# EAGLE schematic PDB2_1 (EAGLE 9.3.0)

## Sheet 1 of 3: BATTERY MANAGEMENT & OUTPUTS
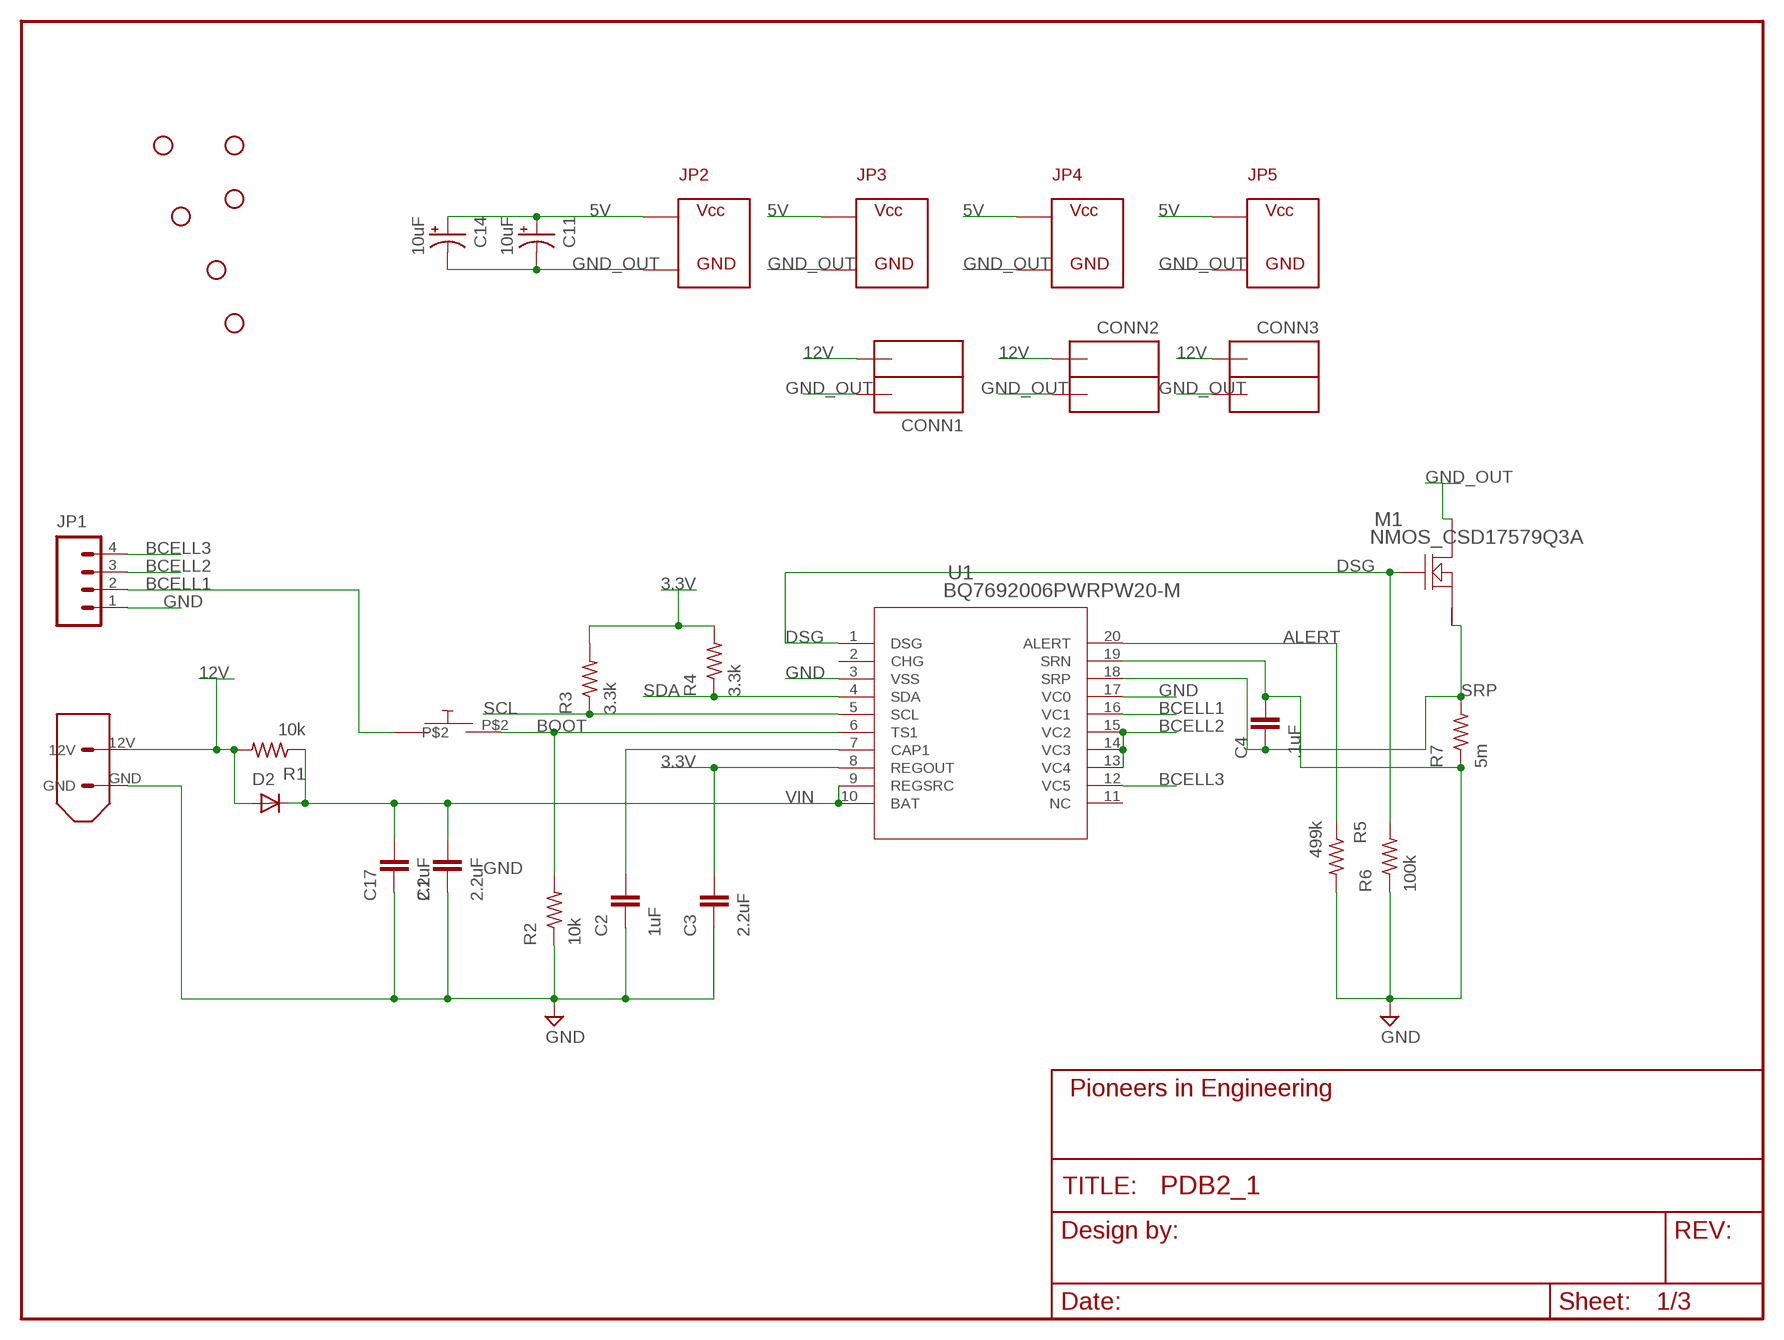
[diagram p0: schematic, sheet 1]
FRAME1 (FRAME_SCHEMATIC): AUTHOR: Sherwin A.

### Parts
C1  2.2uF  CAP0603-CAP  [0603-CAP]
C2  1uF  CAP0603-CAP  [0603-CAP]
C3  2.2uF  CAP0603-CAP  [0603-CAP]
C4  .1uF  CAP0603-CAP  [0603-CAP]
C11  10uF  CAP_POLRADIAL  [.248"CAP_THRU]
C14  10uF  CAP_POLRADIAL  [.248"CAP_THRU]
C17  2.2uF  CAP0603-CAP  [0603-CAP]
CONN1  ANDERSONVERTICAL  [ANDERSON_VERTICAL]
CONN2  ANDERSONVERTICAL  [ANDERSON_VERTICAL]
CONN3  ANDERSONVERTICAL  [ANDERSON_VERTICAL]
D2  D_MBR1020VL  [SOD-123FL]
J1  XT60CONNECTOR  [XT60CONNECTOR]
JP1  M041X04-MTA  [1X04-MTA]
JP2  ATX  [ATX]
JP3  ATX  [ATX]
JP4  ATX  [ATX]
JP5  ATX  [ATX]
M1  NMOS_CSD17579Q3A  [DNH0008A]
R1  10k  R-US_R0603  [R0603]
R2  10k  R-US_R0603  [R0603]
R3  3.3k  R-US_R0603  [R0603]
R4  3.3k  R-US_R0603  [R0603]
R5  499k  R-US_R0603  [R0603]
R6  100k  R-US_R0603  [R0603]
R7  5m  SHUNT_SMD  [SMD_SHUNT]
STANDOFF1  STAND-OFFTIGHT  [STAND-OFF-TIGHT]
STANDOFF2  STAND-OFFTIGHT  [STAND-OFF-TIGHT]
STANDOFF3  STAND-OFFTIGHT  [STAND-OFF-TIGHT]
STANDOFF4  STAND-OFFTIGHT  [STAND-OFF-TIGHT]
STANDOFF5  STAND-OFFTIGHT  [STAND-OFF-TIGHT]
STANDOFF7  STAND-OFFTIGHT  [STAND-OFF-TIGHT]
SW1  PUSH_BUTTON  [BUTTON_K12A]
U1  BQ7692006PWRPW20-M  [PW20-M]

### Nets
3.3V: C3.2 R3.2 R4.2 U1.8(REGOUT) ; also sheet 3
5V: C11.PLUS(+) C14.PLUS(+) JP2.P$1 JP3.P$1 JP4.P$1 JP5.P$1 ; also sheet 2
12V: CONN1.PIN1(OUTB) CONN2.PIN2(OUTA) CONN3.PIN2(OUTA) D2.P$2(A) J1.12V R1.2 ; also sheet 2
ALERT: R5.1 U1.20(ALERT) ; also sheet 3
BCELL1: JP1.2 SW1.P$1 U1.16(VC1)
BCELL2: JP1.3 U1.13(VC4) U1.14(VC3) U1.15(VC2)
BCELL3: JP1.4 U1.12(VC5)
BOOT: R2.2 SW1.P$2 U1.6(TS1) ; also sheet 3
CAP1: C2.2 U1.7(CAP1)
DSG: M1.4(GATE) R6.2 U1.1(DSG)
GND: C1.1 C2.1 C3.1 C4.2 C17.1 J1.GND JP1.1 R2.1 R5.2 R6.1 R7.P$1 U1.3(VSS) U1.17(VC0) U1.19(SRN) ; also sheet 3
GND_OUT: C11.MINUS(-) C14.MINUS(-) CONN1.PIN2(OUTA) CONN2.PIN1(OUTB) CONN3.PIN1(OUTB) JP2.P$2 JP3.P$2 JP4.P$2 JP5.P$2 M1.5(DRAIN_2) M1.6(DRAIN_2) M1.7(DRAIN_2) M1.8(DRAIN_2) M1.9(DRAIN_2) ; also sheet 2
SCL: R3.1 U1.5(SCL) ; also sheet 3
SDA: R4.1 U1.4(SDA) ; also sheet 3
SRP: C4.1 M1.1(SOURCE_2) M1.2(SOURCE_2) M1.3(SOURCE_2) R7.P$2 U1.18(SRP)
VIN: C1.2 C17.2 D2.P$1(C) R1.1 U1.9(REGSRC) U1.10(BAT)
Unconnected: U1.2(CHG) U1.11(NC)

## Sheet 2 of 3: VOLTAGE REGULATOR
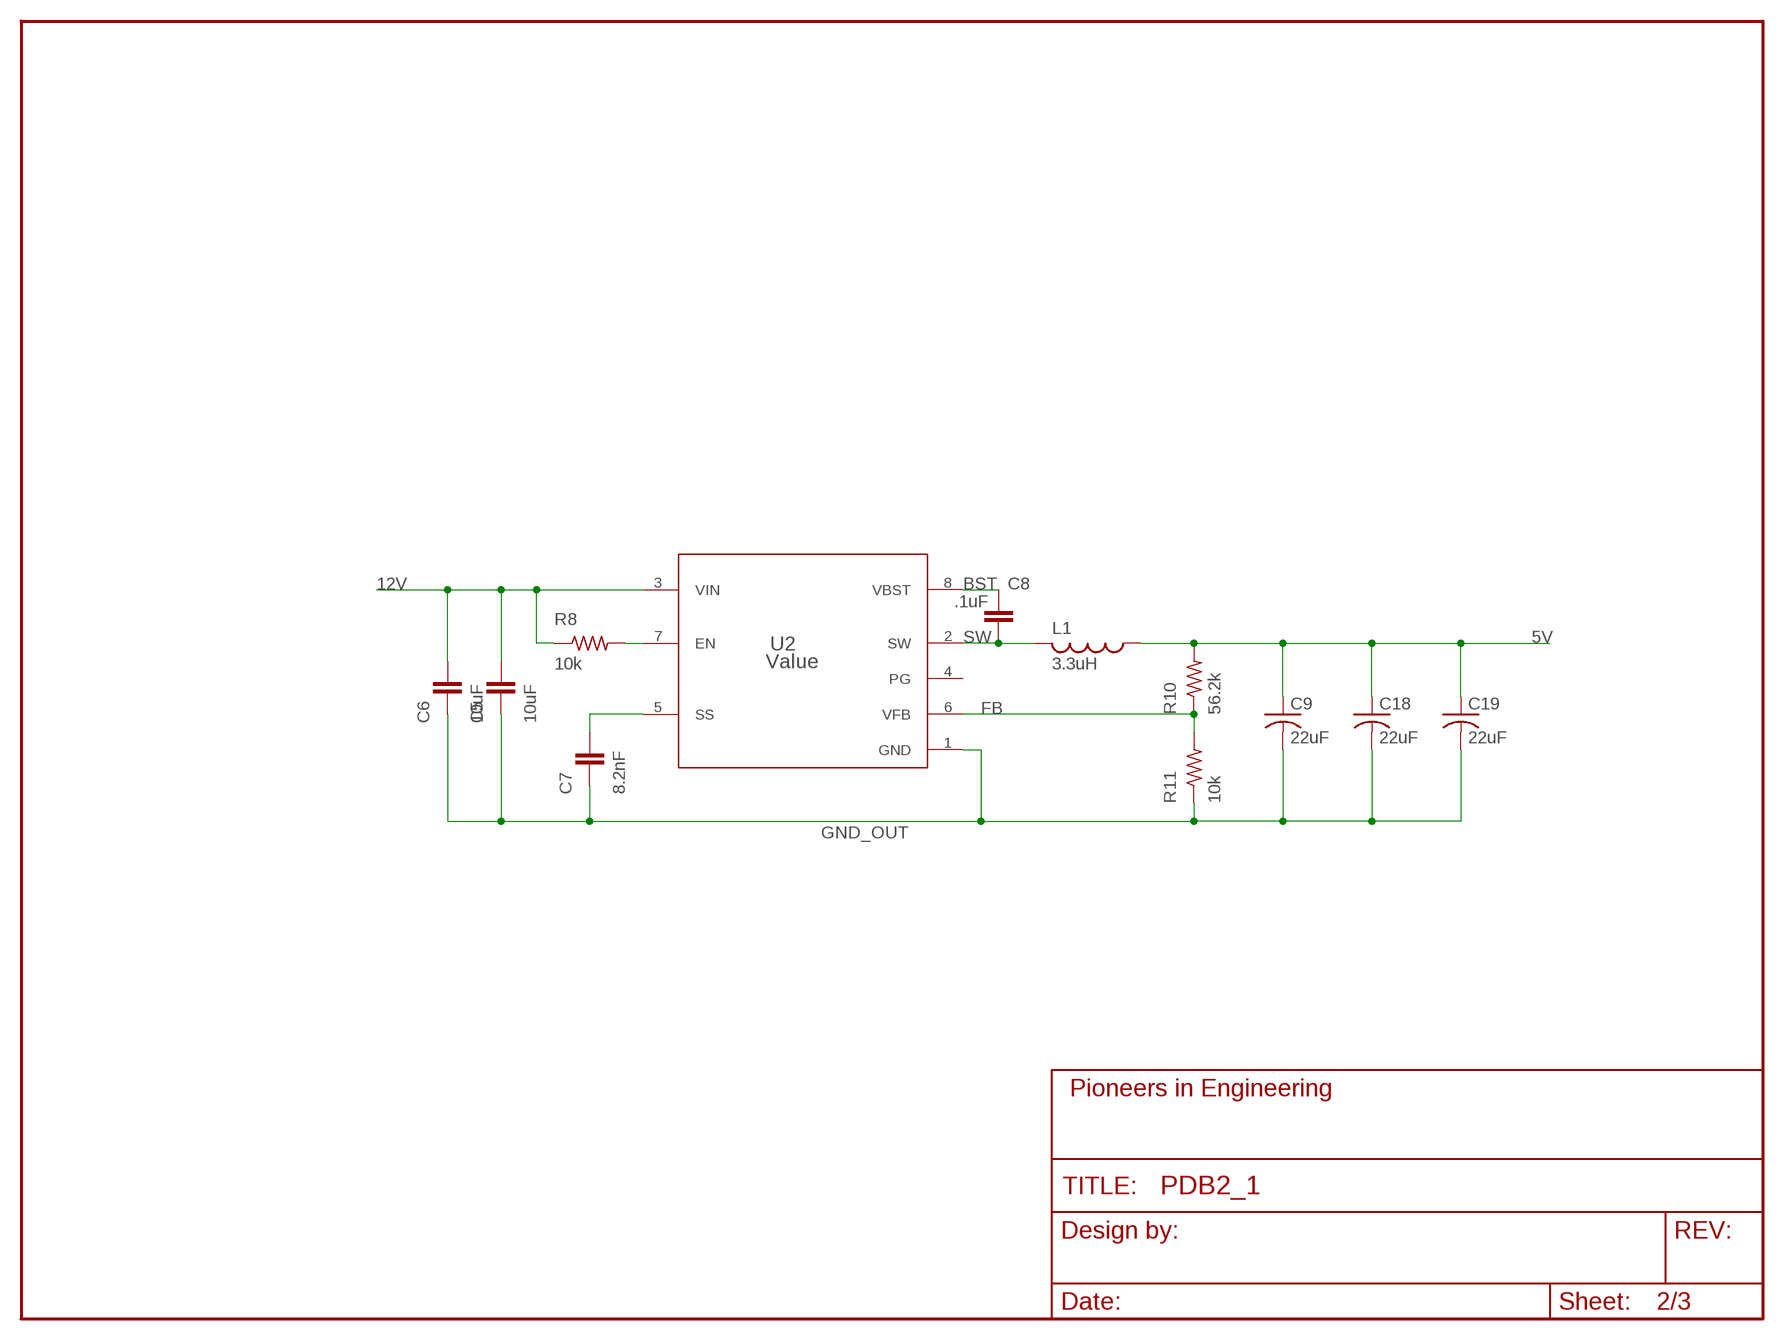
[diagram p1: schematic, sheet 2]

### Parts
C5  10uF  CAP0805  [0805]
C6  10uF  CAP0805  [0805]
C7  8.2nF  CAP0603-CAP  [0603-CAP]
C8  .1uF  CAP0603-CAP  [0603-CAP]
C9  22uF  C-USC0805  [C0805]
C18  22uF  C-USC0805  [C0805]
C19  22uF  C-USC0805  [C0805]
L1  3.3uH  MWSA0420S_INDUCTORMW  [MWSA0402S]
R8  10k  R-US_R0603  [R0603]
R10  56.2k  R-US_R0603  [R0603]
R11  10k  R-US_R0603  [R0603]
U2  Value  TPS563210ADDFR  [DDF0008A_N]

### Nets
5V: C9.1 C18.1 C19.1 L1.P$1 R10.2 ; also sheet 1
12V: C5.2 C6.2 R8.1 U2.3(VIN) ; also sheet 1
BST: C8.1 U2.8(VBST)
FB: R10.1 R11.2 U2.6(VFB)
GND_OUT: C5.1 C6.1 C7.1 C9.2 C18.2 C19.2 R11.1 U2.1(GND) ; also sheet 1
N$9: C7.2 U2.5(SS)
N$27: R8.2 U2.7(EN)
SW: C8.2 L1.P$2 U2.2(SW)
Unconnected: U2.4(PG)

## Sheet 3 of 3: DIGITAL INTERFACE
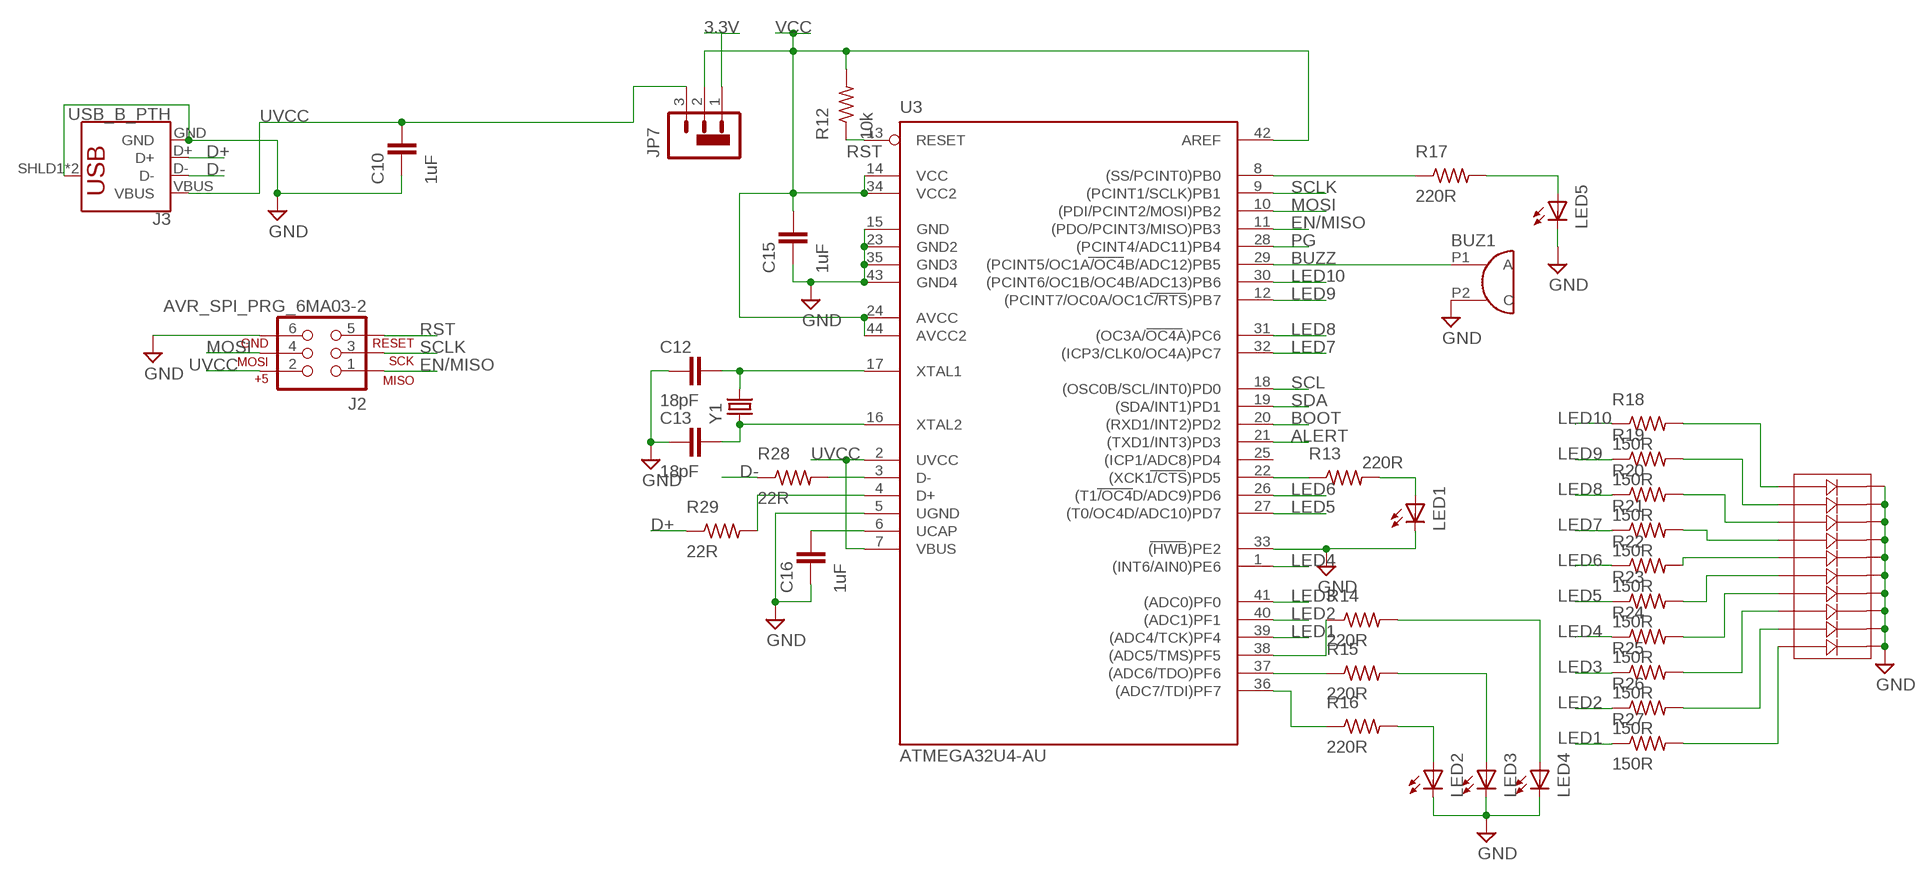
[diagram p2: schematic, sheet 3]

### Parts
BUZ1  BUZZER3.3VBUZZER  [BUZZER_3.3V]
C10  1uF  CAP0603-CAP  [0603-CAP]
C12  18pF  CAP0603-CAP  [0603-CAP]
C13  18pF  CAP0603-CAP  [0603-CAP]
C15  1uF  CAP0603-CAP  [0603-CAP]
C16  1uF  CAP0603-CAP  [0603-CAP]
J2  AVR_SPI_PRG_6MA03-2  [MA03-2]
J3  USB_B_PTH  [USB-B-PTH]
JP7  JMP-OPTION  [1X03-JMP-OPTION]
LED1  LED0805  [LED-0805]
LED2  LED0805  [LED-0805]
LED3  LED0805  [LED-0805]
LED4  LED0805  [LED-0805]
LED5  LED0805  [LED-0805]
LED6  BAR_SEGMENT_DISPLAY  [BAR_SEGMENT_DISPLAY]
R12  10k  R-US_R0603  [R0603]
R13  220R  R-US_R0603  [R0603]
R14  220R  R-US_R0603  [R0603]
R15  220R  R-US_R0603  [R0603]
R16  220R  R-US_R0603  [R0603]
R17  220R  R-US_R0603  [R0603]
R18  150R  R-US_R0603  [R0603]
R19  150R  R-US_R0603  [R0603]
R20  150R  R-US_R0603  [R0603]
R21  150R  R-US_R0603  [R0603]
R22  150R  R-US_R0603  [R0603]
R23  150R  R-US_R0603  [R0603]
R24  150R  R-US_R0603  [R0603]
R25  150R  R-US_R0603  [R0603]
R26  150R  R-US_R0603  [R0603]
R27  150R  R-US_R0603  [R0603]
R28  22R  R-US_R0603  [R0603]
R29  22R  R-US_R0603  [R0603]
U3  ATMEGA32U4-AU  [TQFP44]
Y1  CRYSTAL10.5X4.8  [CRYSTAL-SMD-10.5X4.8-2PIN]

### Nets
3.3V: JP7.1 ; also sheet 1
ALERT: U3.21((TXD1/INT3)PD3) ; also sheet 1
BOOT: U3.20((RXD1/INT2)PD2) ; also sheet 1
BUZZ: BUZ1.P1(A) U3.29((PCINT5/OC1A/OC4B/ADC12)PB5)
D+: J3.D+ R29.1
D-: J3.D- R28.1
EN/MISO: J2.1 U3.11((PDO/PCINT3/MISO)PB3)
GND: BUZ1.P2(C) C10.1 C12.1 C13.1 C15.1 C16.1 J2.6 J3.GND J3.SHLD1(SHIELD) J3.SHLD2(SHIELD) LED1.C LED2.C LED3.C LED4.C LED5.C LED6.BAR_DISPLAY10(P11) LED6.BAR_DISPLAY11(P12) LED6.BAR_DISPLAY12(P13) LED6.BAR_DISPLAY13(P14) LED6.BAR_DISPLAY14(P15) LED6.BAR_DISPLAY15(P16) LED6.BAR_DISPLAY16(P17) LED6.BAR_DISPLAY17(P18) LED6.BAR_DISPLAY18(P19) LED6.BAR_DISPLAY19(P20) U3.5(UGND) U3.15(GND) U3.23(GND2) U3.33((HWB)PE2) U3.35(GND3) U3.43(GND4) ; also sheet 1
LED1: R27.1 U3.39((ADC4/TCK)PF4)
LED2: R26.1 U3.40((ADC1)PF1)
LED3: R25.1 U3.41((ADC0)PF0)
LED4: R24.1 U3.1((INT6/AIN0)PE6)
LED5: R23.1 U3.27((T0/OC4D/ADC10)PD7)
LED6: R22.1 U3.26((T1/OC4D/ADC9)PD6)
LED7: R21.1 U3.32((ICP3/CLK0/OC4A)PC7)
LED8: R20.1 U3.31((OC3A/OC4A)PC6)
LED9: R19.1 U3.12((PCINT7/OC0A/OC1C/RTS)PB7)
LED10: R18.1 U3.30((PCINT6/OC1B/OC4B/ADC13)PB6)
MOSI: J2.4 U3.10((PDI/PCINT2/MOSI)PB2)
N$2: C12.2 U3.17(XTAL1) Y1.P$2
N$3: R28.2 U3.3(D-)
N$4: R29.2 U3.4(D+)
N$5: C13.2 U3.16(XTAL2) Y1.P$1
N$8: C16.2 U3.6(UCAP)
N$12: LED6.BAR_DISPLAY0(P1) R18.2
N$13: LED6.BAR_DISPLAY1(P2) R19.2
N$14: LED6.BAR_DISPLAY2(P3) R20.2
N$15: LED6.BAR_DISPLAY3(P4) R21.2
N$16: LED6.BAR_DISPLAY4(P5) R22.2
N$17: LED6.BAR_DISPLAY5(P6) R23.2
N$18: LED6.BAR_DISPLAY6(P7) R24.2
N$19: LED6.BAR_DISPLAY7(P8) R25.2
N$20: LED6.BAR_DISPLAY8(P9) R26.2
N$21: LED6.BAR_DISPLAY9(P10) R27.2
N$22: R17.1 U3.8((SS/PCINT0)PB0)
N$23: LED5.A R17.2
N$24: LED1.A R13.2
N$25: R13.1 U3.22((XCK1/CTS)PD5)
N$28: R16.1 U3.36((ADC7/TDI)PF7)
N$29: R15.1 U3.37((ADC6/TDO)PF6)
N$30: R14.1 U3.38((ADC5/TMS)PF5)
N$31: LED2.A R16.2
N$32: LED3.A R15.2
N$33: LED4.A R14.2
PG: U3.28((PCINT4/ADC11)PB4)
RST: J2.5 R12.1 U3.13(RESET)
SCL: U3.18((OSC0B/SCL/INT0)PD0) ; also sheet 1
SCLK: J2.3 U3.9((PCINT1/SCLK)PB1)
SDA: U3.19((SDA/INT1)PD1) ; also sheet 1
UVCC: C10.2 J2.2 J3.VBUS JP7.3 U3.2(UVCC) U3.7(VBUS)
VCC: C15.2 JP7.2(COMMON) R12.2 U3.14(VCC) U3.24(AVCC) U3.34(VCC2) U3.42(AREF) U3.44(AVCC2)
Unconnected: U3.25((ICP1/ADC8)PD4)

## Library data of the parts
BUZ1 = pie:BUZZER: Buzzer
C1-C8 C10 C12 C13 C15-C17 = pie:CAP: Capacitor Standard 0603 ceramic capacitor, and 0.1" leaded capacitor.; PIE-INT-REF-NUM: CAPACITOR-GENERIC
C9 C18 C19 = resistor:C-US: CAPACITOR, American symbol
C11 C14 = pie:CAP_POL: Capacitor Polarized These are standard SMD and PTH capacitors. Normally 10uF, 47uF, and 100uF in electrolytic and tantalum varieties. Always verify the external diameter of the through hole cap, it varies with capacity, voltage, and manufacturer. The EIA devices should be standard.
CONN1-CONN3 = pie:ANDERSON: 2-pin 25A Anderson Connector http://www.alliedelec.com/images/products/datasheets/bm/ANDERSON_POWER_PRODUCTS/70162018.pdf; PIE-INT-REF-NUM: Anderson
D2 = pie:D_MBR1020VL; PART_NO: MBR1020VL
J1 = pie:XT60CONNECTOR: 12V XT60 power connector; PARTNUMBER: PRT-10474
J2 = pie:AVR_SPI_PRG_6: AVR ISP 6 Pin This is the reduced ISP connector for AVR programming. Common on Arduino. This footprint will take up less PCB space and can be used with a 10-pin to 6-pin adapter such as SKU: BOB-08508; PIE-INT-REF-NUM: BULK-STOCK
J3 = SparkFun-Connectors:USB_B: USB Type B Connector SparkFun Products: SparkFun Stepoko <https://www.sparkfun.com/products/13899> PTH; PROD_ID: CONN-08278; SF_ID: PRT-00139
JP1 = pie:M04: 4-pin 0.1-inch header and MTA connector; PIE-INT-REF-NUM: MTA
JP2-JP5 = pie:ATX: ATX 2 Pin Connector Crimper: http://www.digikey.com/product-detail/en/molex-llc/0640160204/WM17553-ND/2074099 Housing: http://www.digikey.com/product-detail/en/molex-llc/0019092029/WM4382-ND/2421313 Housing (alternative): http://www.digikey.com/product-detail/en/molex-llc/0015311026/WM1041-ND/313614 Connector: http://www.digikey.com/product-detail/en/molex-llc/0019091029/WM1602-ND/26354 Male crimps: http://www.digikey.com/product-detail/en/molex-llc/0002092103/WM1100-ND/26384 Female crimps: http://www.digikey.com/product-detail/en/molex-llc/0002091104/WM1101-ND/26386
JP7 = pie:JMP-OPTION: A 3 pin header with silk screen indicating jumper positions to select an option.
L1 = pie:MWSA0420S_INDUCTOR
LED1-LED5 = pie:LED: LEDs Standard schematic elements and footprints for 5mm, 3mm, 1206, and 0603 sized LEDs. 5mm - Spark Fun Electronics SKU : COM-00529 (and others); PIE-INT-REF-NUM: LED
LED6 = pie:BAR_SEGMENT_DISPLAY
M1 = pie:NMOS_CSD17579Q3A; MANUFACTURER_PART_NUMBER: CSD16401Q5; VENDOR: Texas Instruments
R1-R6 R8 R10-R29 = pie:R-US_: RESISTOR, American symbol; DESCRIPTION: RESISTOR, American symbol; DISTRIBUTOR: DigiKey; MANUFACTURER: Rohm Semiconductor; NOTES: Cut Tape; PACKAGE: R0603; VALUE: >VALUE
R7 = pie:SHUNT_SMD; MANUFACTURER_PART_NO: WSHM28185L000FEA
STANDOFF1-STANDOFF5 STANDOFF7 = pie:STAND-OFF: #4 Stand Off This is the mechanical footprint for a #4 phillips button head screw. Use the keepout ring to avoid running the screw head into surrounding components. SKU : PRT-00447; PIE-INT-REF-NUM: DNL
SW1 = pie:PUSH_BUTTON
U1 = pie:BQ7692006PWR; MANUFACTURER_PART_NUMBER: BQ7692006PWR; VENDOR: Texas Instruments
U2 = pie:TPS563210ADDFR; MANUFACTURER: Texas Instruments; MANUFACTURER_NAME: Texas Instruments; MANUFACTURER_PART_NUMBER: TPS563210ADDFR; PARTNUMBER: TPS563210ADDFR; REFDES: RefDes; TYPE: TYPE
U3 = pie:ATMEGA32U4-AU; PIE-DIGIKEY-PN-ALT1: ATMEGA32U4-MURCT-ND; PIE-DIGIKEY-PN-PRI: ATMEGA32U4RC-MURCT-ND; PIE-INT-REF-NUM: ATmega32U4
Y1 = pie:CRYSTAL: Various standard crystals. Proven footprints. Spark Fun Electronics SKU : COM-00534; PART_NO: ECS-160-20-3X-EN-TR; PIE-INT-REF-NUM: CRYSTAL